# EAGLE design untitled (EAGLE 8.2.1)
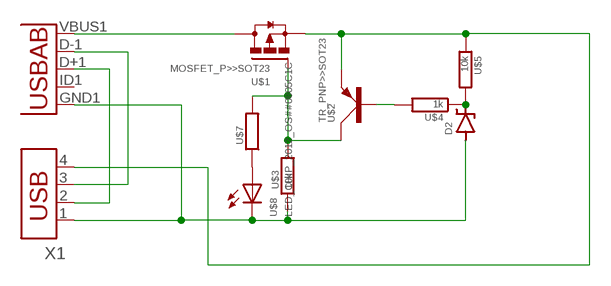
[diagram p0: schematic, sheet 1]

## Parts
D2  ZENER-DIODE>>SOD-323  [SOD323-W]
U1  USB""  [USB-MICRO-SMD]
U$1  MOSFET_P>>SOT23  [SOT23]
U$2  TR_PNP>>SOT23  [SOT23]
U$3  10k  REGISTER>>2012  [2012]
U$4  1k  REGISTER>>2012  [2012]
U$5  10k  REGISTER>>2012  [2012]
U$7  REGISTER>>2012  [2012]
U$8  LED_CHIP_2012_OS##0805C1C  [2012_OS##0805C1C]
X1  USB-787616  [USB]

## Nets
N$2: U1.D+1(D+) X1.2
N$3: U1.D-1(D-) X1.3
N$4: U$1.2(S) U$2.2(E) U$5.1 X1.4
N$5: U1.VBUS1(VBUS) U$1.3(D)
N$6: U$1.1(G) U$2.3(C) U$3.2 U$7.2
N$7: U$2.1(B) U$4.2
N$8: D2.C U$4.1 U$5.2
N$9: U$7.1 U$8.P$1(A)
N$10: D2.A U1.GND1(GND) U$3.1 U$8.P$2(C) X1.1
Unconnected: U1.ID1(USBID)

## Library data of the parts
D2 = !diode(ﾀﾞｲｵｰﾄﾞ):ZENER-DIODE>>: Z-Diode
U1 = MicroUSB:USB: This is a USB AB connector that is compatible with USB OTG. i.e. this connector can serve as a host or device
U$1 = !FET_transister_v-reg:MOSFET_P>>
U$2 = !FET_transister_v-reg:TR_PNP>>
U$3-U$5 U$7 = SMD:REGISTER>>
U$8 = !led:LED_CHIP
X1 = con-amp:USB-787616: AMP connector

## Board
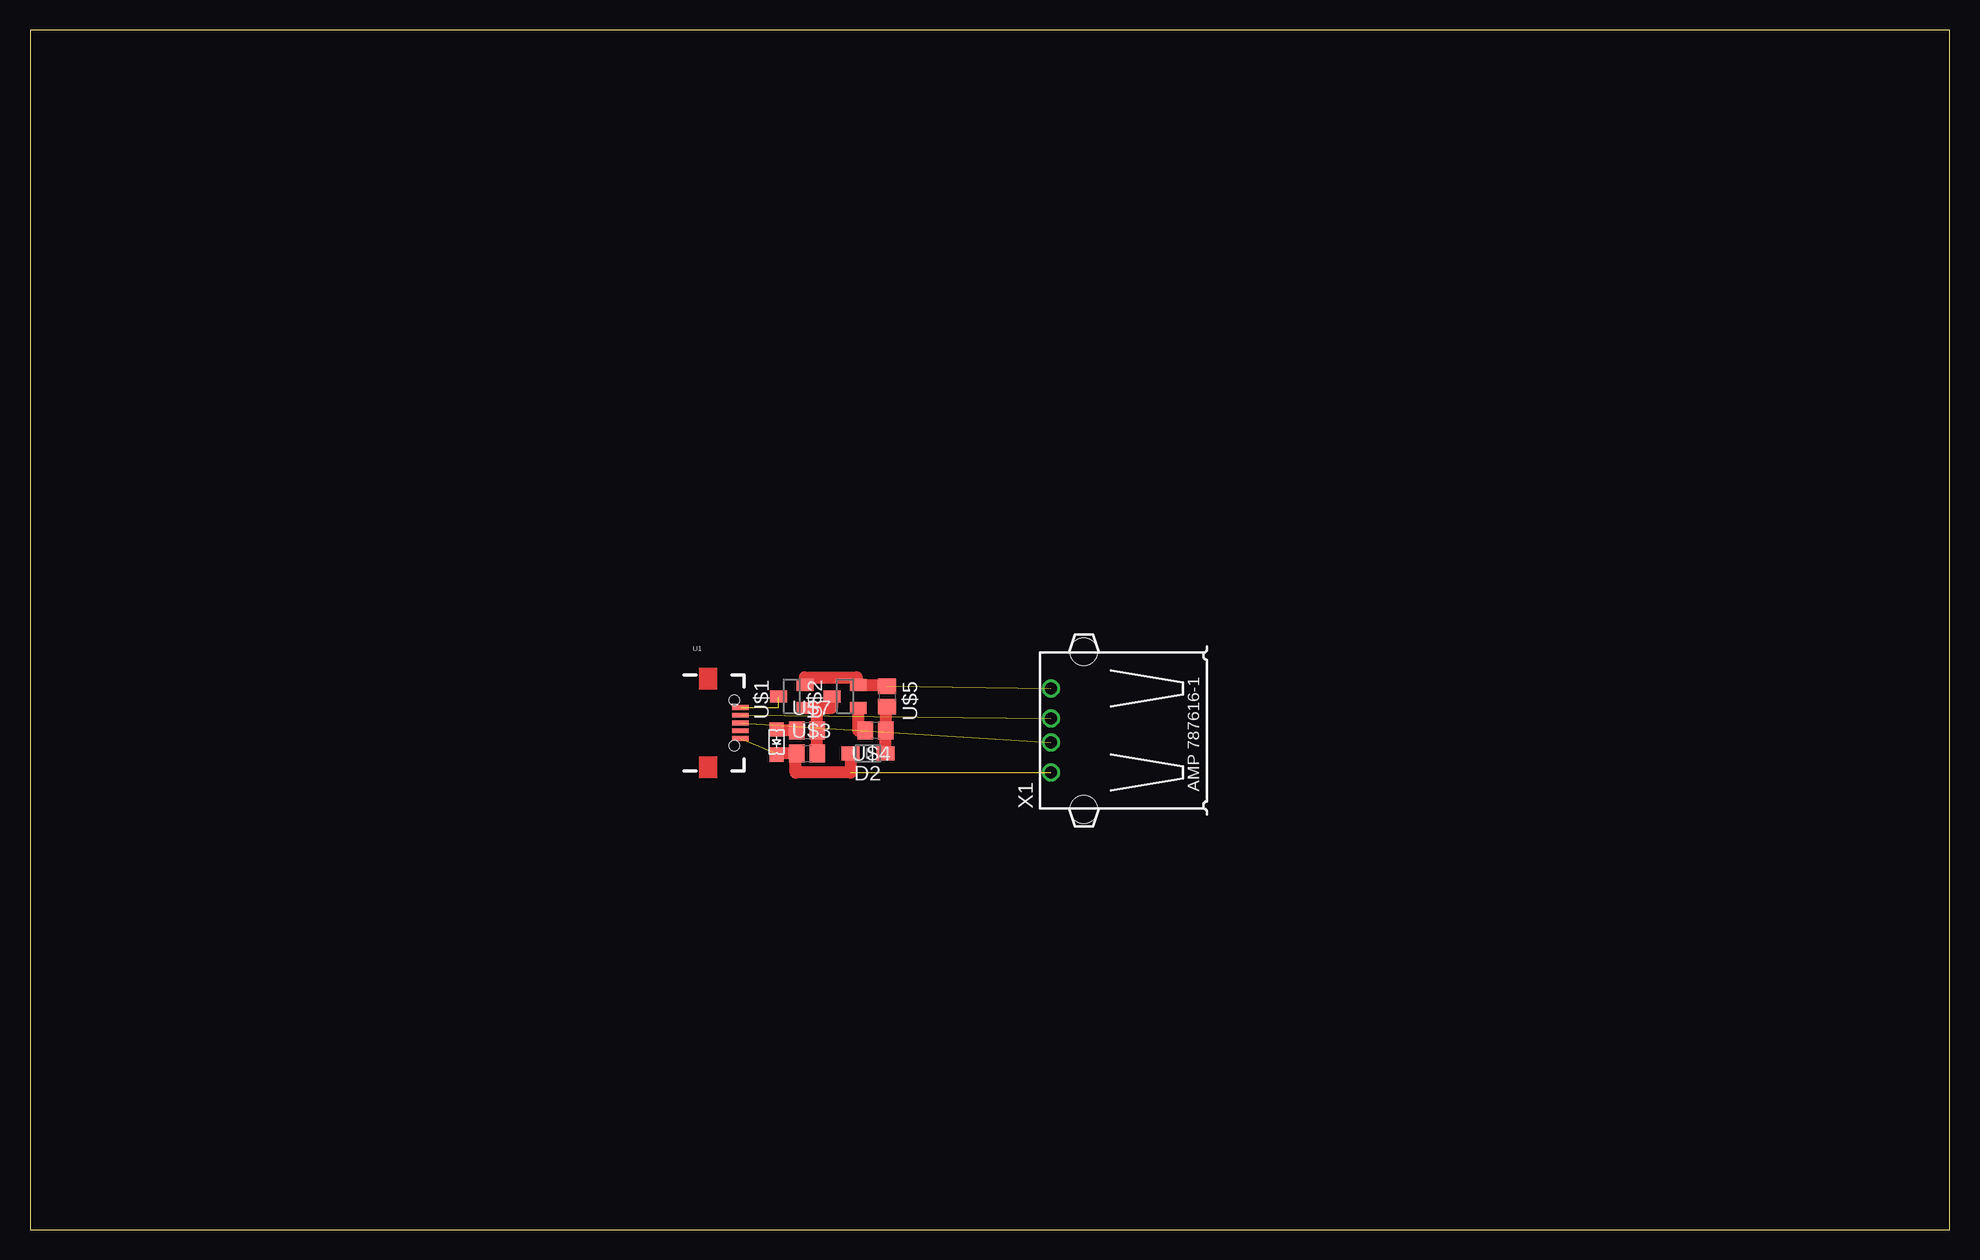
[diagram p1: board, top side]

Size 160 x 100 mm. Coordinates in mm from the lower left corner, seen from the top.
Outline: 0,0 160,0 160,100 0,100 0,0
Copper layers (1*16): Top 0.035mm / dielectric 1.5mm / Bottom 0.035mm
Design rules "default": minimum track width 6mil, minimum drill 0.35mm, track to track 6mil, track to pad 6mil, pad to pad 6mil, via to via 6mil, smd to smd 6mil, copper to edge 40mil, drill to drill 6mil, minimum pad ring 10mil, minimum via ring 8mil, stop-mask expansion 4mil, vias tented up to drill 0mil, thermal gap 10mil

### Footprints (pad centres in the part's own frame; a part is rotated, then mirrored left to right if it is on the bottom)
SOD323-W = smd 1.5 x 1.2: A 1.45,0; C -1.45,0
USB-MICRO-SMD = smd 1.4 x 0.4: D+1 2.7,0; D-1 2.7,0.65; GND1 2.7,-1.3; ID1 2.7,-0.65; VBUS1 2.7,1.3 | hole 0.85: 2.2,1.9; 2.2,-1.9
SOT23 = smd 1 x 1.4: 1 -0.95,-1.1; 2 0.95,-1.1; 3 0,1.1
2012 = smd 1.3 x 1.5: 1 -0.85,0; 2 0.85,0
2012_OS##0805C1C = smd 1.2 x 1.2: P$1 -1.05,0; P$2 1.05,0
USB = drill 1: 1 -3.5,12.99; 2 -1,12.99; 3 1,12.99; 4 3.5,12.99 | hole 2.3: -6.57,10.28; 6.57,10.28

### Placement (x,y rotation side)
D2  69.85,39.69 180 top
U1  56.52,42.23 0 top
U$1  63.5,44.45 90 top
U$2  67.94,44.45 90 top
U$3  64.77,39.69 0 top
U$4  70.48,41.59 180 top
U$5  71.44,44.45 270 top
U$7  64.77,41.59 0 top
U$8  62.23,40.64 270 top
X1  98.11,41.59 90 top

### Tracks (layer width: path | path; a pad name or v marks a point on that pad's centre or on a via)
N$2  (1 unrouted)
N$3  (1 unrouted)
N$4  (1 unrouted)
  Top 1.016: U$1.2 64.6,46.04 68.9,46.04 68.9,45.4 U$2.2 71.44,45.4 U$5.1
N$5  (2 unrouted)
N$6
  Top 1.016: U$2.3 66.84,43.5 65.72,43.5 65.62,43.5 | U$3.2 U$7.2 65.62,43.5 | 65.62,43.5 U$1.1
N$7
  Top 1.016: U$4.2 69.05,41.59 U$2.1
N$8
  Top 1.016: U$5.2 71.33,43.6 U$4.1 71.3,41.59 D2.C
N$9
  Top 1.016: U$7.1 62.23,41.59 U$8.P$1
N$10  (2 unrouted)
  Top 1.016: U$8.P$2 62.23,39.69 U$3.1 63.82,39.69 63.82,38.1 68.4,38.1 D2.A